# EAGLE schematic oshpark2.0 (EAGLE 6.6.0)
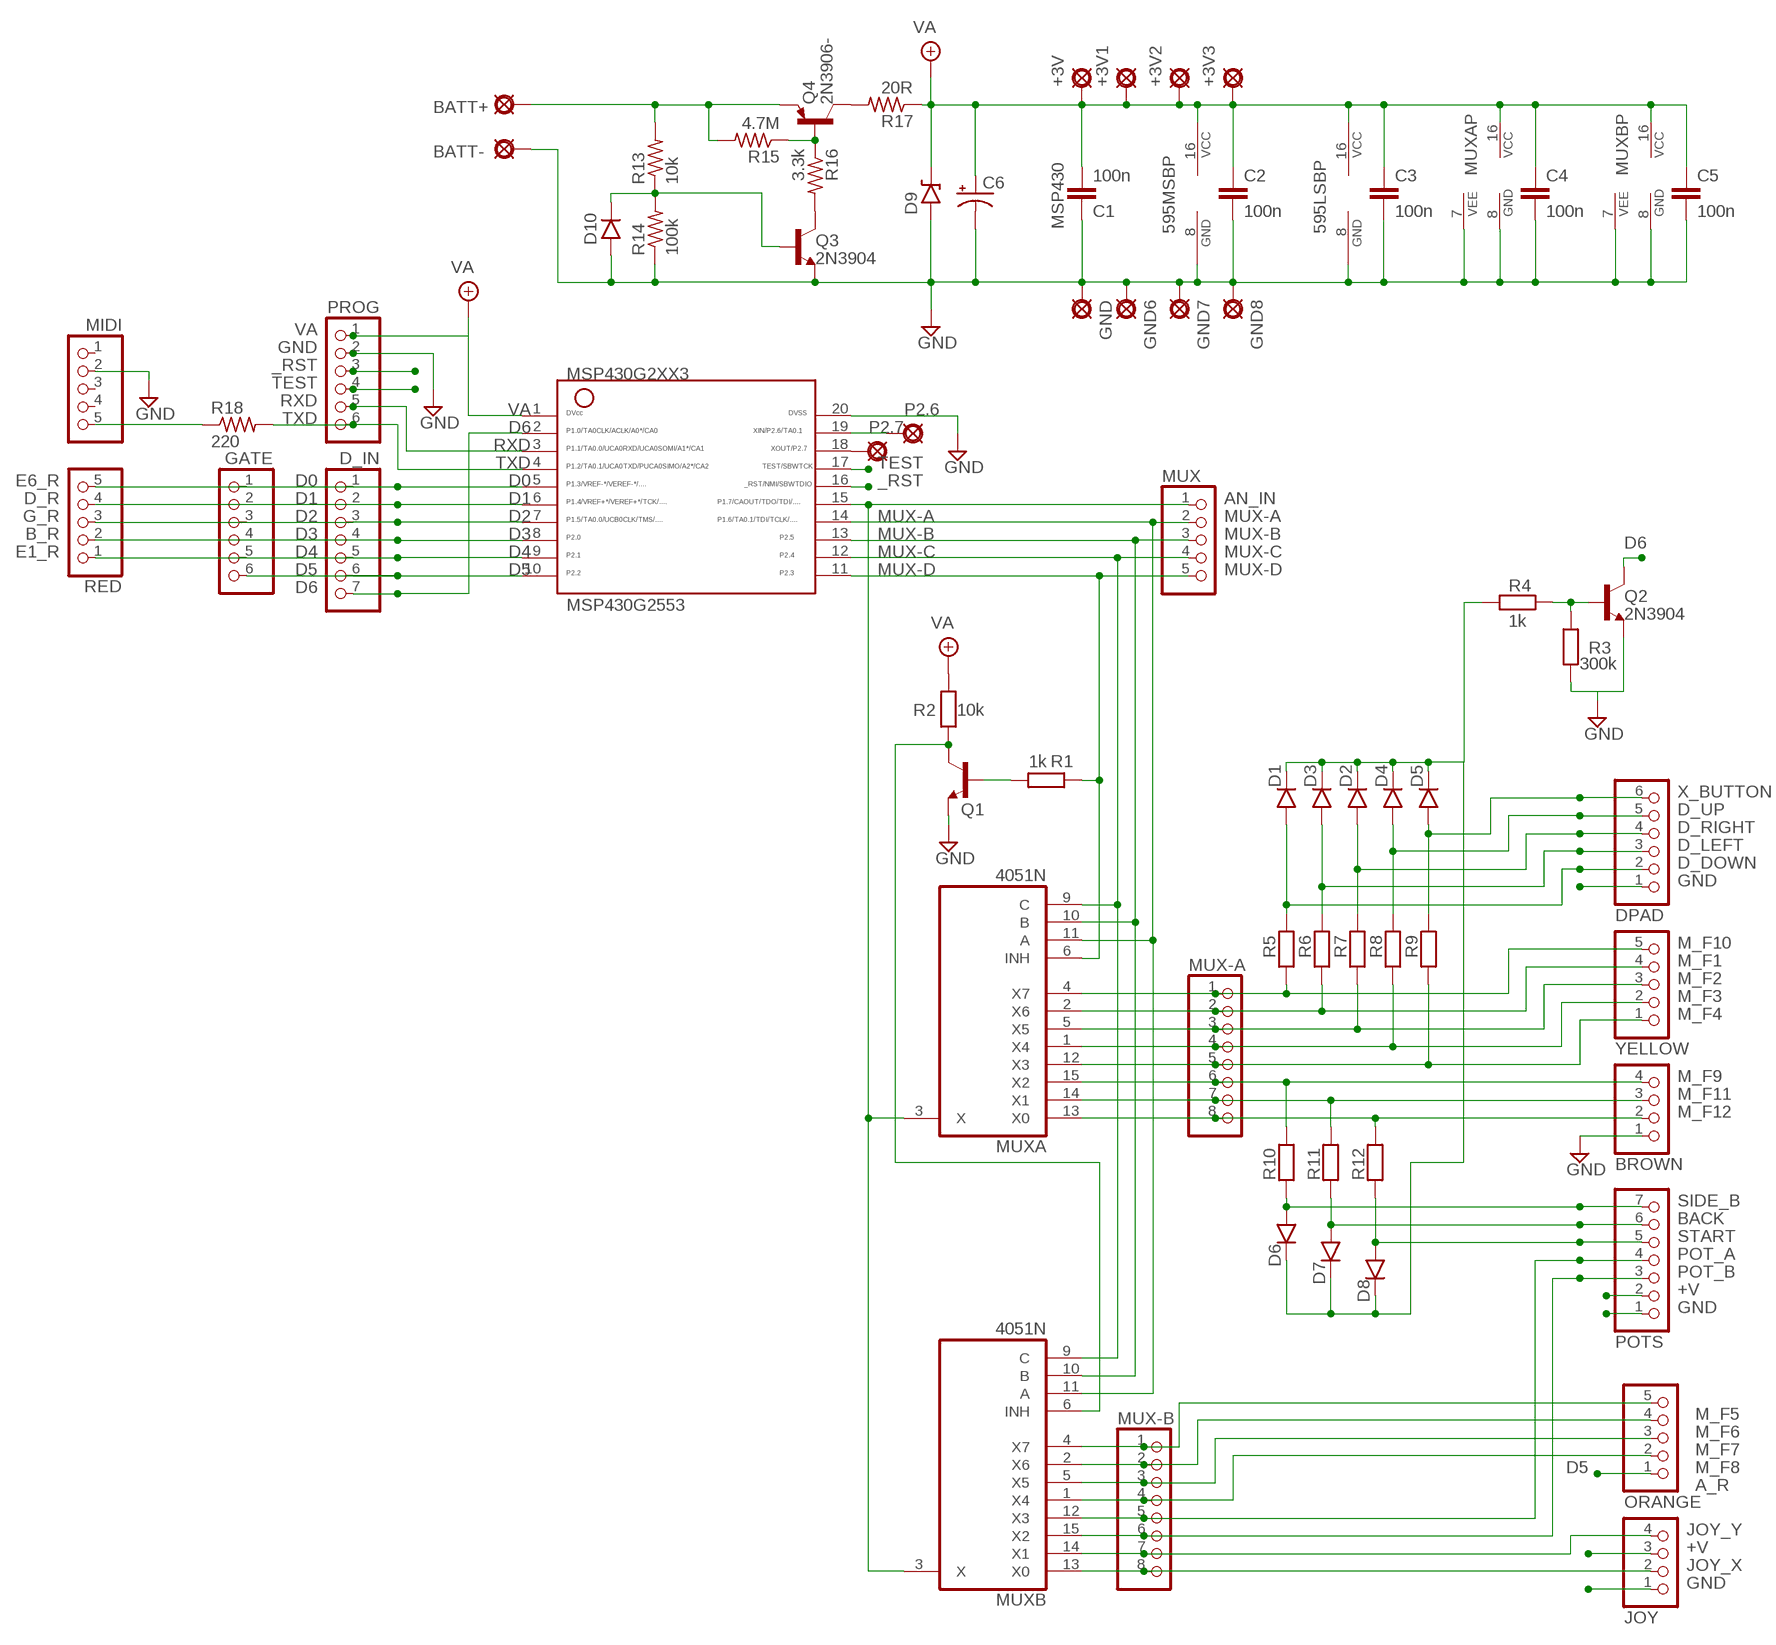
[diagram p0: schematic, sheet 1]

## Parts
595LSB  74LS595N  [DIL16]
595MSB  74LS595N  [DIL16]
+3V  PAD8  [OCTOGON]
+3V1  PAD8  [OCTOGON]
+3V2  PAD8  [OCTOGON]
+3V3  PAD8  [OCTOGON]
BATT+  PADL  [LONG]
BATT-  PADL  [LONG]
BROWN  PINHD-1X4  [1X04]
C1  100n  050X030_050  [050X030_050_3]
C2  100n  050X030_050  [050X030_050_3]
C3  100n  050X030_050  [050X030_050_3]
C4  100n  050X030_050  [050X030_050_3]
C5  100n  050X030_050  [050X030_050_3]
C6  050  [050_020]
D1  1N4148-2  [DO35-2]
D2  1N4148-2  [DO35-2]
D3  1N4148-2  [DO35-2]
D4  1N4148-2  [DO35-2]
D5  1N4148-2  [DO35-2]
D6  1N4148-2  [DO35-2]
D7  1N4148-2  [DO35-2]
D8  1N4148-2  [DO35-2]
D9  1N9ZENER  [DO35-3]
D10  1N4148-2  [DO35-2]
D_IN  PINHD-1X7  [1X07]
DPAD  PINHD-1X6  [1X06]
GATE  PINHD-1X6  [1X06]
GND  PAD  [SQUARE]
GND6  PAD  [SQUARE]
GND7  PAD  [SQUARE]
GND8  PAD  [SQUARE]
JOY  PINHD-1X4  [1X04]
MIDI  PINHD-1X5  [1X05]
MSP430G2553  G2XX3---N20  [N20]
MUX  PINHD-1X5  [1X05]
MUX-A  PINHD-1X8  [1X08]
MUX-B  PINHD-1X8  [1X08]
MUXA  4051N  [DIL16]
MUXB  4051N  [DIL16]
ORANGE  PINHD-1X5  [1X05]
P2.6  PADO  [ROUND]
P2.7  PADO  [ROUND]
POTS  PINHD-1X7  [1X07]
PROG  PINHD-1X6  [1X06]
Q1  2N3904  [TO92-]
Q2  2N3904  [TO92-]
Q3  2N3904  [TO92-]
Q4  2N3906-  [TO92-]
R1  1k  6MM-EU  [R0207/3]
R2  10k  6MM-EU  [R0207/3]
R3  300k  6MM-EU1  [R0207/1V]
R4  1k  6MM-EU  [R0207/3]
R5  30k  6MM-EU  [R0207/3]
R6  30k  6MM-EU  [R0207/3]
R7  30k  6MM-EU  [R0207/3]
R8  30k  6MM-EU  [R0207/3]
R9  30k  6MM-EU  [R0207/3]
R10  30k  6MM-EU  [R0207/3]
R11  30k  6MM-EU  [R0207/3]
R12  30k  6MM-EU  [R0207/3]
R13  10k  6MM.3  [R0207/3]
R14  100k  6MM.3  [R0207/3]
R15  4.7M  6MM.3  [R0207/3]
R16  3.3k  6MM.3  [R0207/3]
R17  20R  6MM.3  [R0207/3]
R18  220  6MM.3  [R0207/3]
RED  PINHD-1X5  [1X05]
YELLOW  PINHD-1X5  [1X05]

## Nets
+V: JOY.3 POTS.2
_RST: MSP430G2553.16 PROG.3
AN_IN: MSP430G2553.15 MUX.1 MUXA.3(X) MUXB.3(X)
BACK: D7.A POTS.6 R11.2
BATT+: BATT+.1(PAD) Q4.3(E) R13.2 R15.2
D0: D_IN.1 GATE.1 MSP430G2553.5 RED.5
D1: D_IN.2 GATE.2 MSP430G2553.6 RED.4
D2: D_IN.3 GATE.3 MSP430G2553.7 RED.3
D3: D_IN.4 GATE.4 MSP430G2553.8 RED.2
D4: D_IN.5 GATE.5 MSP430G2553.9 RED.1
D5: D_IN.6 GATE.6 MSP430G2553.10 ORANGE.1
D6: D_IN.7 MSP430G2553.2 Q2.1(C)
D_DOWN: D1.A DPAD.2 R5.2
D_LEFT: D3.A DPAD.3 R6.2
D_RIGHT: D2.A DPAD.4 R7.2
D_UP: D4.A DPAD.5 R8.2
GND: 595LSB.8(GND) 595MSB.8(GND) BATT-.1(PAD) BROWN.1 C1.1 C2.2 C3.2 C4.2 C5.2 C6.- D9.A D10.A DPAD.1 GND6.1(PAD) GND7.1(PAD) GND8.1(PAD) GND.1(PAD) JOY.1 MIDI.2 MSP430G2553.20 MUXA.7(VEE) MUXA.8(GND) MUXB.7(VEE) MUXB.8(GND) POTS.1 PROG.2 Q1.3(E) Q2.3(E) Q3.3(E) R3.2 R14.1
JOY_X: JOY.2 MUX-B.8 MUXB.13(X0)
JOY_Y: JOY.4 MUX-B.7 MUXB.14(X1)
M_F1: MUX-A.2 MUXA.2(X6) R6.1 YELLOW.4
M_F2: MUX-A.3 MUXA.5(X5) R7.1 YELLOW.3
M_F3: MUX-A.4 MUXA.1(X4) R8.1 YELLOW.2
M_F4: MUX-A.5 MUXA.12(X3) R9.1 YELLOW.1
M_F5: MUX-B.1 MUXB.4(X7) ORANGE.5
M_F6: MUX-B.2 MUXB.2(X6) ORANGE.4
M_F7: MUX-B.3 MUXB.5(X5) ORANGE.3
M_F8: MUX-B.4 MUXB.1(X4) ORANGE.2
M_F9: BROWN.4 MUX-A.6 MUXA.15(X2) R10.1
M_F10: MUX-A.1 MUXA.4(X7) R5.1 YELLOW.5
M_F11: BROWN.3 MUX-A.7 MUXA.14(X1) R11.1
M_F12: BROWN.2 MUX-A.8 MUXA.13(X0) R12.1
MUX-A: MSP430G2553.14 MUX.2 MUXA.11(A) MUXB.11(A)
MUX-B: MSP430G2553.13 MUX.3 MUXA.10(B) MUXB.10(B)
MUX-C: MSP430G2553.12 MUX.4 MUXA.9(C) MUXB.9(C)
MUX-D: MSP430G2553.11 MUX.5 MUXA.6(INH) R1.1
N$1: MIDI.5 R18.1
N$3: Q1.2(B) R1.2
N$5: MSP430G2553.19 P2.6.1(PAD)
N$6: MSP430G2553.18 P2.7.1(PAD)
N$7: Q2.2(B) R3.1 R4.2
N$11: D10.C Q3.2(B) R13.1 R14.2
N$14: D8.A R12.2
N$15: Q4.2(B) R15.1 R16.1
N$17: Q3.1(C) R16.2
N$19: D1.C D2.C D3.C D4.C D5.C D6.C D7.C D8.C R4.1
N$20: Q4.1(C) R17.2
POT_A: MUX-B.5 MUXB.12(X3) POTS.4
POT_B: MUX-B.6 MUXB.15(X2) POTS.3
RXD: MSP430G2553.3 PROG.5
SIDE_B: D6.A POTS.7 R10.2
START: POTS.5
TEST: MSP430G2553.17 PROG.4
TXD: MSP430G2553.4 PROG.6 R18.2
VA: 595LSB.16(VCC) 595MSB.16(VCC) +3V1.1(PAD) +3V2.1(PAD) +3V3.1(PAD) +3V.1(PAD) C1.2 C2.1 C3.1 C4.1 C5.1 C6.+ D9.C MSP430G2553.1 MUXA.16(VCC) MUXB.16(VCC) PROG.1 R2.2 R17.1
X_BUTTON: D5.A DPAD.6 R9.2
~MUX-D: MUXB.6(INH) Q1.1(C) R2.1
Unconnected: 595LSB.1(QB) 595LSB.2(QC) 595LSB.3(QD) 595LSB.4(QE) 595LSB.5(QF) 595LSB.6(QG) 595LSB.7(QH) 595LSB.9(QH*) 595LSB.10(SCL) 595LSB.11(SCK) 595LSB.12(RCK) 595LSB.13(G) 595LSB.14(SER) 595LSB.15(QA) 595MSB.1(QB) 595MSB.2(QC) 595MSB.3(QD) 595MSB.4(QE) 595MSB.5(QF) 595MSB.6(QG) 595MSB.7(QH) 595MSB.9(QH*) 595MSB.10(SCL) 595MSB.11(SCK) 595MSB.12(RCK) 595MSB.13(G) 595MSB.14(SER) 595MSB.15(QA) MIDI.1 MIDI.3 MIDI.4

## Notes on the sheet
- MSP430
- E6_R
- D_R
- G_R
- B_R
- E1_R
- A_R

## Library data of the parts
595LSB 595MSB = 74xx-us:74*595: 8-bit SHIFT REGISTER, output latch
+3V +3V1-+3V3 BATT+ BATT- GND GND6-GND8 P2.6 P2.7 = gm-supply:PAD: PAD use this package for pads with any purpose, including input, output, send or return various pad shapes: round, square, octogonal, long, and long offset
BROWN JOY = pinhead:PINHD-1X4: PIN HEADER
C1-C5 = gm-caps-ceramic:050X030_050: 120 - 150pF Xicon Ceramic Disc 5mm lead spacing
C6 = gm-caps-electro-pol:050: 0.22 - 100uF Xicon values at Mouser.com: 10V: 10 - 100uF; 16V: 2.2 - 47uF; 25V: 0.47 - 47uF; 50V: 0.22 - 22uF
D1-D8 D10 = gm-diodes:1N4148: Fast Switching Diode DO-35 glass case a.k.a. 1N914
D9 = gm-diodes:1N9*ZENER: 1N9???B Zener Diode DO-35 case 1N957B - 1N992B (6.8V to 200V)
D_IN POTS = pinhead:PINHD-1X7: PIN HEADER
DPAD GATE PROG = pinhead:PINHD-1X6: PIN HEADER
MIDI MUX ORANGE RED YELLOW = pinhead:PINHD-1X5: PIN HEADER
MSP430G2553 = TI_MSP430_v16:G2XX3---N20: MSP430G2XX1 PDIP (N) 20 Pin Package
MUX-A MUX-B = pinhead:PINHD-1X8: PIN HEADER
MUXA MUXB = 40xx:4051: 8-channel ANALOG MULTIPLEXER
Q1-Q3 = gm-trans:2N3904: NPN Transistor
Q4 = gm-trans:2N3906: PNP Transistor
R1-R12 = gm-resistors:6MM-EU: 6mm Resistors (European schematic symbol) Leads spaced 1-6 holes apart for 0.1" perfboard. Suitable for 1/4 watt resistors.
R13-R18 = gm-resistors:6MM: 6mm Resistors Leads spaced 1-6 holes apart for 0.1" perfboard. Suitable for 1/4 watt resistors.